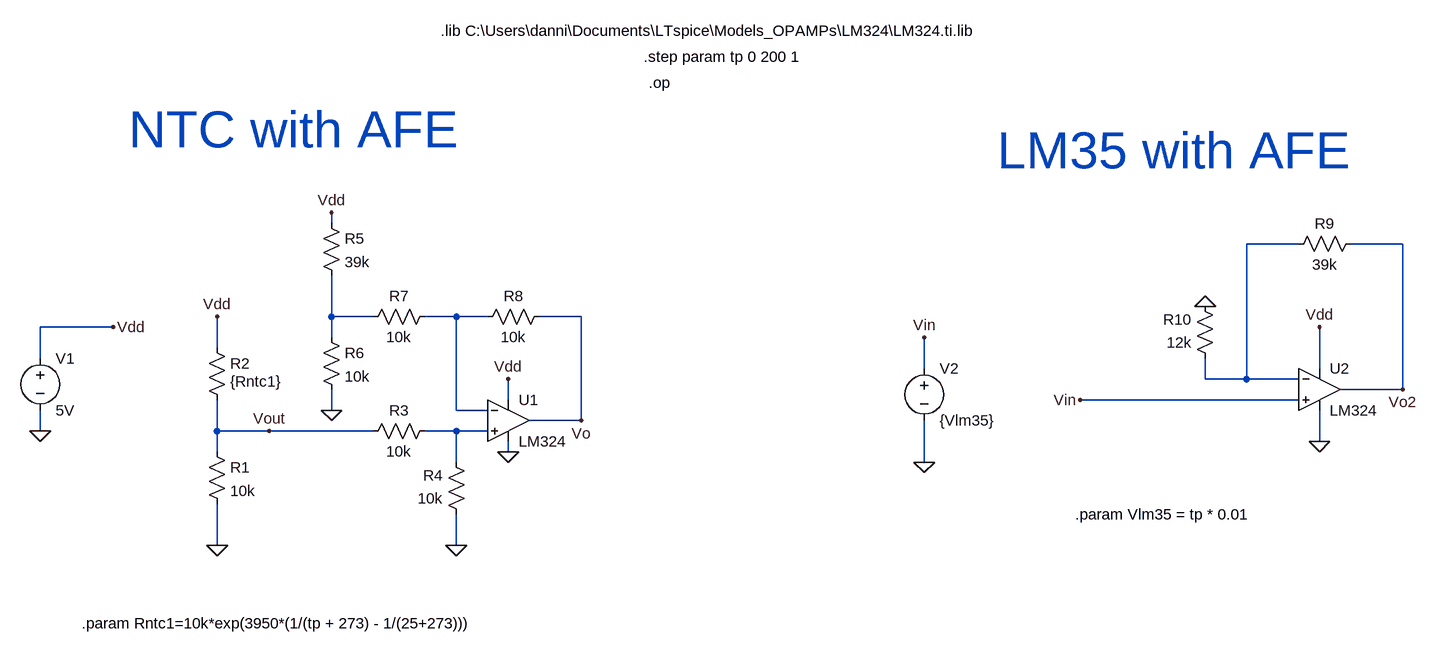
[diagram p0: schematic NTC&LM35.asc]
NTC&LM35.asc, the LTspice schematic file:
Version 4.1
SHEET 1 1608 680
WIRE -80 -112 -80 -128
WIRE 1408 -80 1328 -80
WIRE 1568 -80 1488 -80
WIRE -80 32 -80 -32
WIRE -16 32 -80 32
WIRE 112 32 64 32
WIRE 160 32 112 32
WIRE 304 32 240 32
WIRE -416 48 -528 48
WIRE -80 64 -80 32
WIRE -256 80 -256 32
WIRE -528 96 -528 48
WIRE 832 112 832 64
WIRE 1440 112 1440 48
WIRE 1264 128 1264 96
WIRE 1328 128 1328 -80
WIRE 1328 128 1264 128
WIRE 1408 128 1328 128
WIRE 1568 144 1568 -80
WIRE 1568 144 1472 144
WIRE 192 160 192 128
WIRE 1408 160 1072 160
WIRE -80 176 -80 144
WIRE 112 176 112 32
WIRE 160 176 112 176
WIRE 304 192 304 32
WIRE 304 192 224 192
WIRE -528 208 -528 176
WIRE -256 208 -256 160
WIRE -176 208 -256 208
WIRE -16 208 -176 208
WIRE 112 208 64 208
WIRE 160 208 112 208
WIRE 1440 224 1440 176
WIRE -256 240 -256 208
WIRE 192 240 192 224
WIRE 112 256 112 208
WIRE 832 256 832 192
WIRE -256 384 -256 320
WIRE 112 384 112 336
FLAG -528 208 0
FLAG -416 48 Vdd
FLAG -256 32 Vdd
FLAG -256 384 0
FLAG -176 208 Vout
FLAG 112 384 0
FLAG -80 176 0
FLAG -80 -128 Vdd
FLAG 192 240 0
FLAG 192 128 Vdd
FLAG 304 192 Vo
FLAG 832 256 0
FLAG 832 64 Vin
FLAG 1072 160 Vin
FLAG 1440 224 0
FLAG 1440 48 Vdd
FLAG 1568 144 Vo2
FLAG 1264 16 0
SYMBOL voltage -528 80 R0
SYMATTR InstName V1
SYMATTR Value 5V
SYMBOL res -272 64 R0
WINDOW 3 36 68 Left 2
SYMATTR Value {Rntc1}
SYMATTR InstName R2
SYMBOL res -272 224 R0
SYMATTR InstName R1
SYMATTR Value 10k
SYMBOL OpAmps\\opamp2 192 128 R0
SYMATTR InstName U1
SYMATTR Value LM324
SYMBOL res 80 192 R90
WINDOW 0 0 56 VBottom 2
WINDOW 3 32 56 VTop 2
SYMATTR InstName R3
SYMATTR Value 10k
SYMBOL res 128 352 R180
WINDOW 0 36 76 Left 2
WINDOW 3 36 40 Left 2
SYMATTR InstName R4
SYMATTR Value 10k
SYMBOL res -96 -128 R0
SYMATTR InstName R5
SYMATTR Value 39k
SYMBOL res -96 48 R0
SYMATTR InstName R6
SYMATTR Value 10k
SYMBOL res 80 16 R90
WINDOW 0 0 56 VBottom 2
WINDOW 3 32 56 VTop 2
SYMATTR InstName R7
SYMATTR Value 10k
SYMBOL res 256 16 R90
WINDOW 0 0 56 VBottom 2
WINDOW 3 32 56 VTop 2
SYMATTR InstName R8
SYMATTR Value 10k
SYMBOL voltage 832 96 R0
WINDOW 123 0 0 Left 0
WINDOW 39 0 0 Left 0
SYMATTR InstName V2
SYMATTR Value {Vlm35}
SYMBOL OpAmps\\opamp2 1440 80 R0
SYMATTR InstName U2
SYMATTR Value LM324
SYMBOL res 1504 -96 R90
WINDOW 0 0 56 VBottom 2
WINDOW 3 32 56 VTop 2
SYMATTR InstName R9
SYMATTR Value 39k
SYMBOL res 1280 112 R180
WINDOW 0 36 76 Left 2
WINDOW 3 36 40 Left 2
SYMATTR InstName R10
SYMATTR Value 12k
TEXT -464 504 Left 2 !.param Rntc1=10k*exp(3950*(1/(tp + 273) - 1/(25+273)))
TEXT 400 -368 Left 2 !.step param tp 0 200 1
TEXT 408 -328 Left 2 !.op
TEXT 88 -408 Left 2 !.lib C:\\Users\\danni\\Documents\\LTspice\\Models_OPAMPs\\LM324\\LM324.ti.lib
TEXT 1064 336 Left 2 !.param Vlm35 = tp * 0.01
TEXT -392 -256 Left 6 ;NTC with AFE
TEXT 944 -224 Left 6 ;LM35 with AFE

The netlist it stands for:
* NTC&LM35.asc
V1 Vdd 0 5V
R2 Vdd Vout {Rntc1}
R1 Vout 0 10k
X§U1 N004 N003 Vdd 0 Vo LM324  ; pins In+ In- V+ V- OUT
R3 N004 Vout 10k
R4 0 N004 10k
R5 Vdd N002 39k
R6 N002 0 10k
R7 N003 N002 10k
R8 Vo N003 10k
V2 Vin 0 {Vlm35}
X§U2 Vin N001 Vdd 0 Vo2 LM324  ; pins In+ In- V+ V- OUT
R9 Vo2 N001 39k
R10 N001 0 12k
.param Rntc1=10k*exp(3950*(1/(tp + 273) - 1/(25+273)))
.step param tp 0 200 1
.op
.lib C:\Users\danni\Documents\LTspice\Models_OPAMPs\LM324\LM324.ti.lib
.param Vlm35 = tp * 0.01
* NTC with AFE
* LM35 with AFE
.backanno
.end